# EAGLE design rgbbOX2 (EAGLE 9.0.0)

## Sheet 1 of 2: brains
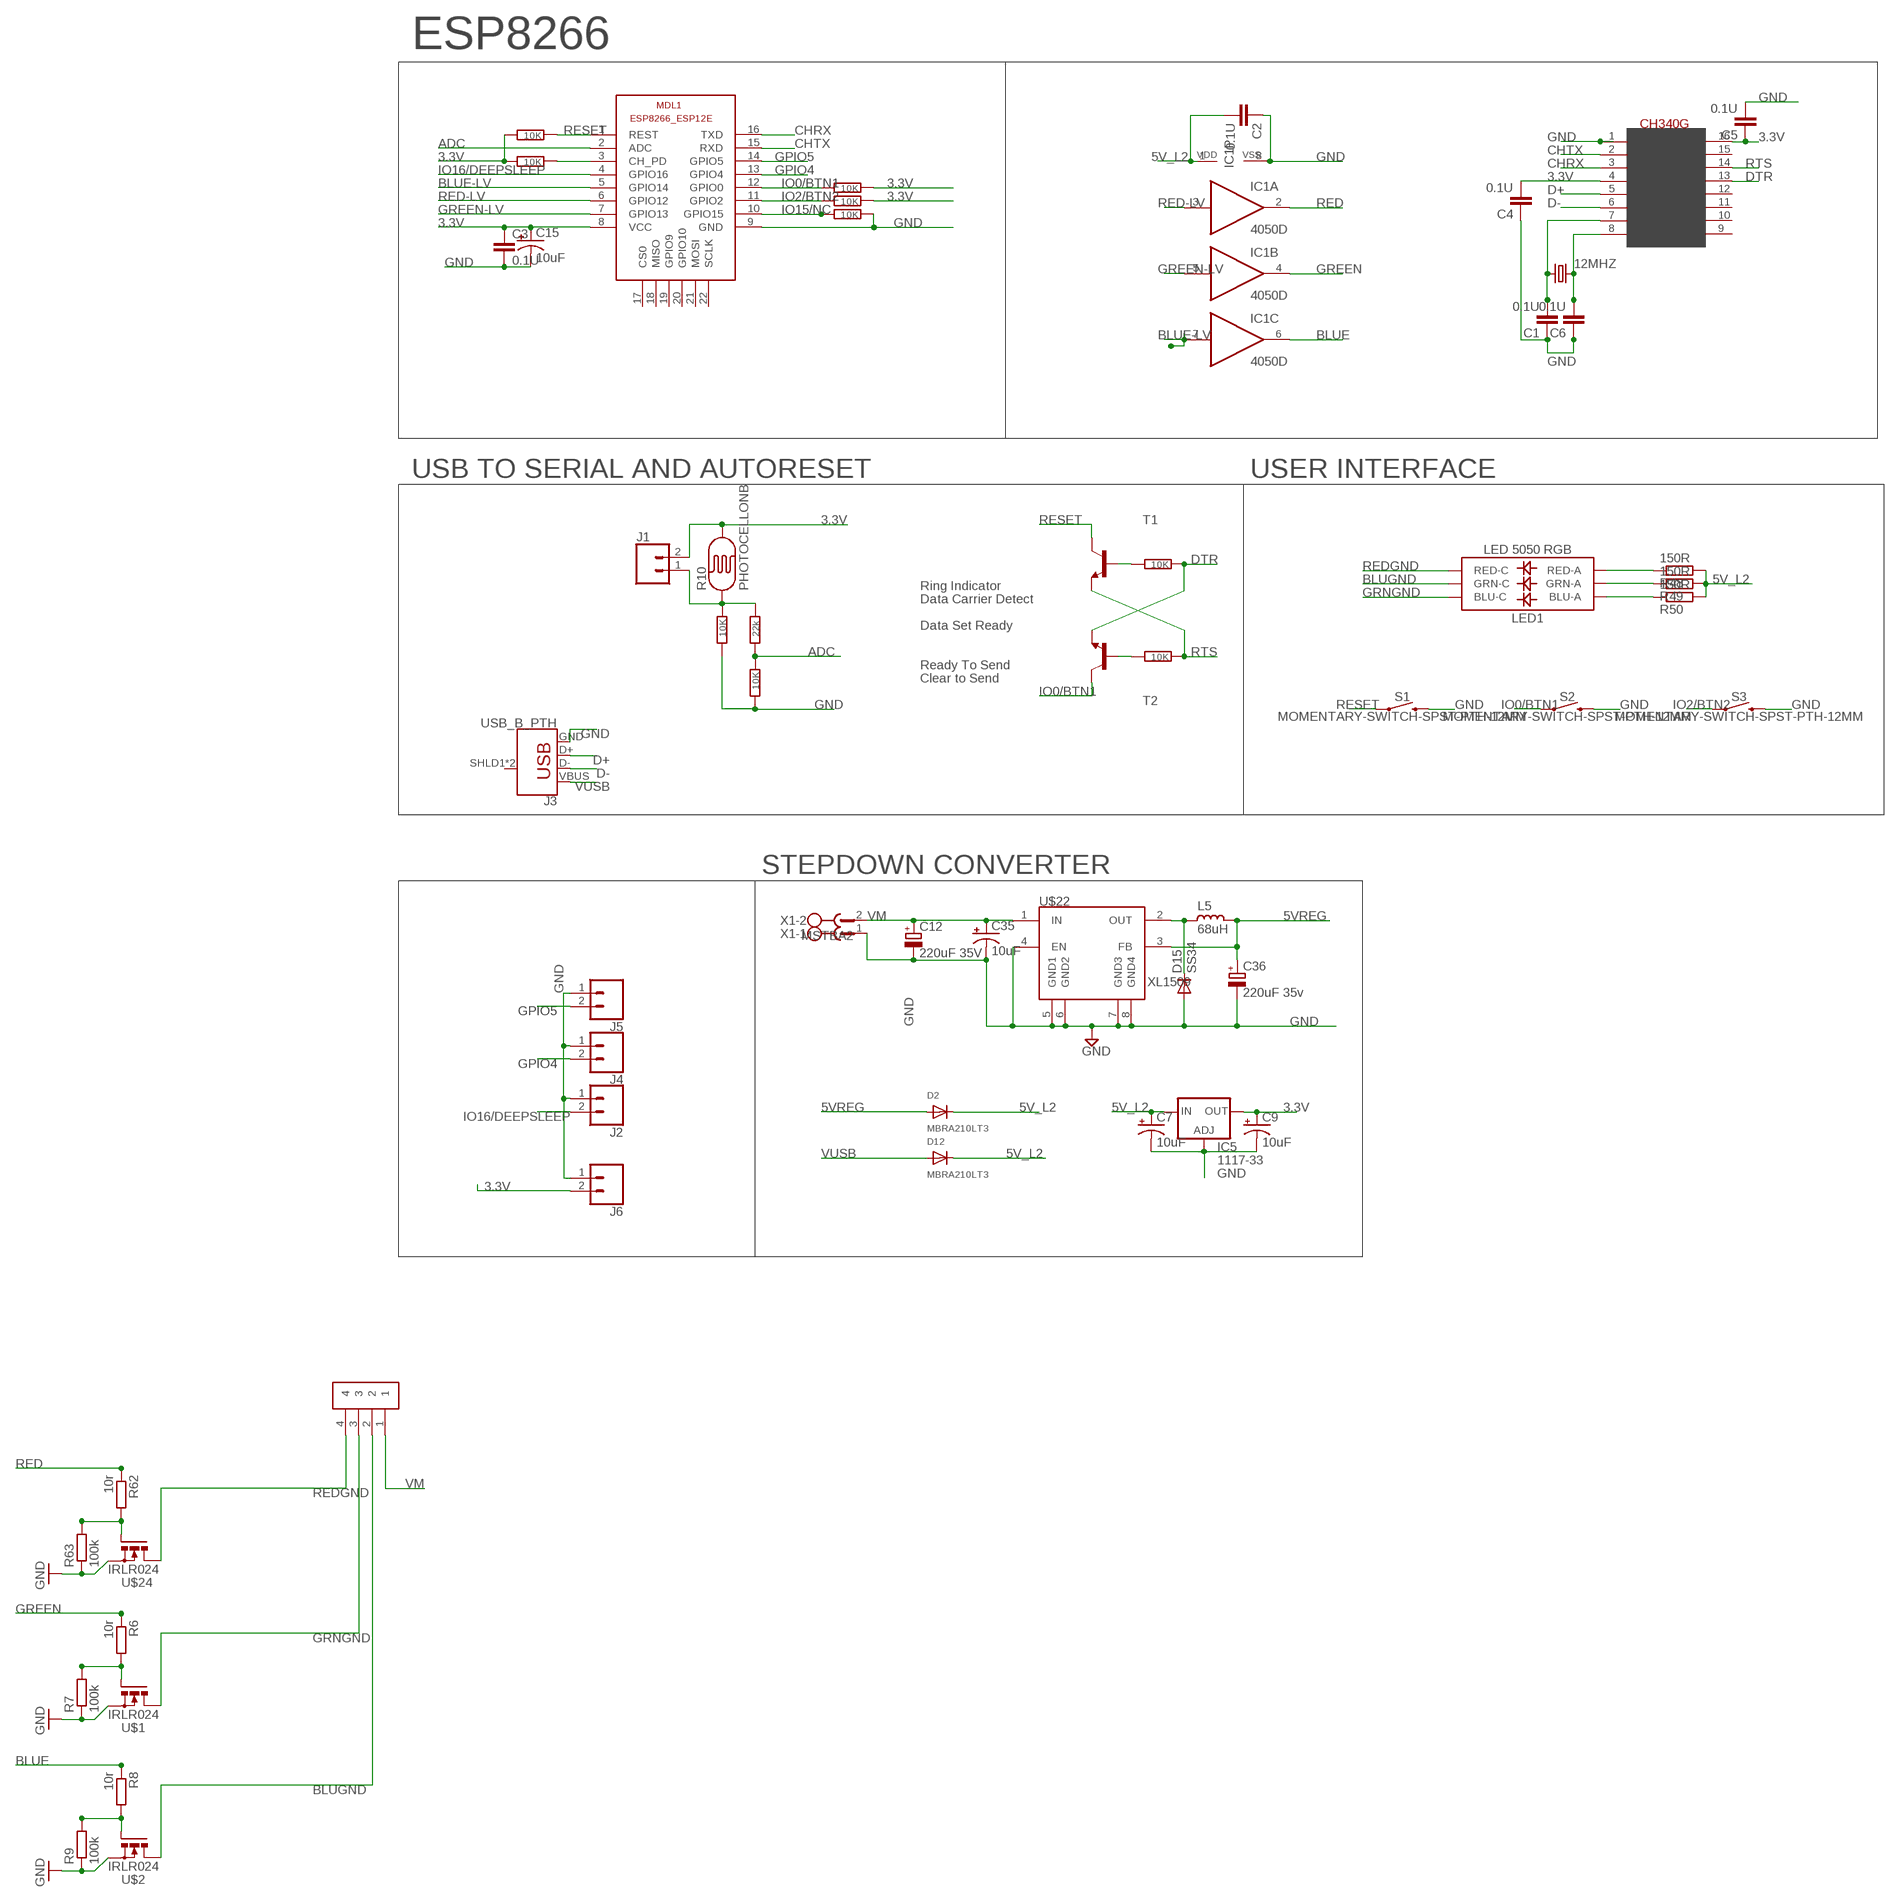
[diagram p0: schematic, sheet 1]

### Parts
12MHZ  CRYSTALHC49UP  [HC49UP]
C1  0.1U  C-EUC1206  [C1206]
C2  0.1U  C-EUC1206  [C1206]
C3  0.1U  C-EUC1206  [C1206]
C4  0.1U  C-EUC1206  [C1206]
C5  0.1U  C-EUC1206  [C1206]
C6  0.1U  C-EUC1206  [C1206]
C7  10uF  CAP_POL1206  [EIA3216]
C9  10uF  CAP_POL1206  [EIA3216]
C12  220uF 35V  CPOL-EUE3.5-8  [E3,5-8]
C15  10uF  CAP_POL1206  [EIA3216]
C35  10uF  CAP_POL1206  [EIA3216]
C36  220uF 35v  CPOL-EUE3.5-8  [E3,5-8]
CON25  Phoenix Pluggable 3.81mm 4 way  CONNECTOR-M4  [3.81MM-4WAY-PLUGGABLE-SCREW]
D2  MBRA210LT3  DIODESMA  [SMADIODE]
D12  MBRA210LT3  DIODESMA  [SMADIODE]
D15  SS34  DIODE-DO-214AC  [DO-214AC]
IC1  4050D  [SO16]
IC5  1117-33  LD117AS33TR  [SOT223]
J1  CONN_02LOCK  [1X02_LOCK]
J2  CONN_02LOCK  [1X02_LOCK]
J3  USB_B_PTH  [USB-B-PTH]
J4  CONN_02LOCK  [1X02_LOCK]
J5  CONN_02LOCK  [1X02_LOCK]
J6  CONN_02LOCK  [1X02_LOCK]
L5  68uH  L_CD75  [CD75]
LED1  LED 5050 RGB  LED-RGBNO_IC  [LED-TRICOLOR-5050]
MDL1  ESP8266-12EESP8266-ESP12E  [ESP8266-ESP12E]
R1  10K  R-EU_R1206  [R1206]
R2  10K  R-EU_R1206  [R1206]
R3  22k  R-EU_R1206  [R1206]
R4  10K  R-EU_R1206  [R1206]
R5  10K  R-EU_R1206  [R1206]
R6  10r  R-EU_R1206  [R1206]
R7  100k  R-EU_R1206  [R1206]
R8  10r  R-EU_R1206  [R1206]
R9  100k  R-EU_R1206  [R1206]
R10  PHOTOCELLONB  [ON_BOARD]
R11  10K  R-EU_R1206  [R1206]
R12  10K  R-EU_R1206  [R1206]
R28  10K  R-EU_R1206  [R1206]
R29  10K  R-EU_R1206  [R1206]
R31  10K  R-EU_R1206  [R1206]
R48  150R  R-EU_R1210  [R1210]
R49  150R  R-EU_R1210  [R1210]
R50  150R  R-EU_R1210  [R1210]
R62  10r  R-EU_R1206  [R1206]
R63  100k  R-EU_R1206  [R1206]
S1  MOMENTARY-SWITCH-SPST-PTH-12MM  [TACTILE_SWITCH_PTH_12MM]
S2  MOMENTARY-SWITCH-SPST-PTH-12MM  [TACTILE_SWITCH_PTH_12MM]
S3  MOMENTARY-SWITCH-SPST-PTH-12MM  [TACTILE_SWITCH_PTH_12MM]
T1  MMBT2222ALT1-NPN-SOT23-BEC  [SOT23-BEC]
T2  MMBT2222ALT1-NPN-SOT23-BEC  [SOT23-BEC]
U$1  IRLR024  N-POWER-MOSFETDPAK-MOSFET  [D-PAK_TO252AA]
U$2  IRLR024  N-POWER-MOSFETDPAK-MOSFET  [D-PAK_TO252AA]
U$4  CH340G  [SOIC16]
U$22  XL1509  [SO08]
U$24  IRLR024  N-POWER-MOSFETDPAK-MOSFET  [D-PAK_TO252AA]
X1  MSTBA2  [MSTBA2]

### Nets
3.3V: C3.1 C4.2 C5.1 C9.A(+) C15.A(+) IC5.4(OUT) J1.2 J6.2 MDL1.8(VCC) R10.2 R11.2 R12.2 R28.1 R29.1 U$4.4(V3) U$4.16(VCC)
5V_L2: C2.2 C7.A(+) D2.C D12.C IC1.1(P:VDD) IC5.3(IN) R48.2 R49.2 R50.2
5VREG: C36.+ D2.A L5.1 U$22.3(FB)
ADC: MDL1.2(ADC) R3.1 R4.2
BLUE: IC1.6(C:O) R8.1
BLUE-LV: IC1.7(C:I) MDL1.5(GPIO14)
BLUGND: CON25.2 LED1.6(GRN-C) U$2.4(D)
CHRX: MDL1.16(TXD) U$4.3(RX)
CHTX: MDL1.15(RXD) U$4.2(TX)
D+: J3.D+ U$4.5(D+)
D-: J3.D- U$4.6(D-)
DTR: R1.2 T2.E U$4.13(DTR)
GND: C1.1 C2.1 C3.2 C4.1 C5.2 C6.1 C7.C(-) C9.C(-) C12.- C15.C(-) C35.C(-) C36.- D15.2(A) IC1.8(P:VSS) IC5.1(ADJ) J2.1 J3.GND J4.1 J5.1 J6.1 MDL1.9(GND) R4.1 R5.1 R7.1 R9.1 R31.2 R63.1 S1.3 S2.3 S3.3 U$1.3(S) U$2.3(S) U$4.1(GND) U$22.4(EN) U$22.5(GND1) U$22.6(GND2) U$22.7(GND3) U$22.8(GND4) U$24.3(S) X1.1
GPIO4: J4.2 MDL1.13(GPIO4)
GPIO5: J5.2 MDL1.14(GPIO5)
GREEN: IC1.4(B:O) R6.1
GREEN-LV: IC1.5(B:I) MDL1.7(GPIO13)
GRNGND: CON25.3 LED1.4(BLU-C) U$1.4(D)
IO0/BTN1: MDL1.12(GPIO0) R12.1 S2.1 T2.C
IO2/BTN2: MDL1.11(GPIO2) R11.1 S3.1
IO15/NC: MDL1.10(GPIO15) R31.1
IO16/DEEPSLEEP: J2.2 MDL1.4(GPIO16)
N$2: R6.2 R7.2 U$1.1(G)
N$3: R62.2 R63.2 U$24.1(G)
N$4: D15.1(C) L5.2 U$22.2(OUT)
N$5: 12MHZ.1 C1.2 U$4.7(XI)
N$6: 12MHZ.2 C6.2 U$4.8(XO)
N$7: R8.2 R9.2 U$2.1(G)
N$9: R1.1 T1.B
N$10: R2.1 T2.B
N$15: J1.1 R3.2 R5.2 R10.1
N$18: MDL1.3(CH_PD) R28.2
N$93: LED1.3(BLU-A) R50.1
N$94: LED1.1(GRN-A) R49.1
N$95: LED1.2(RED-A) R48.1
RED: IC1.2(A:O) R62.1
RED-LV: IC1.3(A:I) MDL1.6(GPIO12)
REDGND: CON25.4 LED1.5(RED-C) U$24.4(D)
RESET: MDL1.1(REST) R29.2 S1.1 T1.C
RTS: R2.2 T1.E U$4.14(RTS)
VM: C12.+ C35.A(+) CON25.1 U$22.1(IN) X1.2
VUSB: D12.A J3.VBUS
Unconnected: IC1.9(D:I) IC1.10(D:O) IC1.11(E:I) IC1.12(E:O) IC1.14(F:I) IC1.15(F:O) J3.SHLD1(SHIELD) J3.SHLD2(SHIELD) MDL1.17(CS0) MDL1.18(MISO) MDL1.19(GPIO9) MDL1.20(GPIO10) MDL1.21(MOSI) MDL1.22(SCLK) U$4.9(CTS) U$4.10(DSR) U$4.11(RI) U$4.12(DCD) U$4.15(RS232)

### Notes on the sheet
- ESP8266
- USB TO SERIAL AND AUTORESET | USER INTERFACE
- Ring Indicator
- Data Carrier Detect
- Data Set Ready
- Ready To Send
- Clear to Send
- STEPDOWN CONVERTER

## Sheet 2 of 2

## Library data of the parts
12MHZ = crystal:CRYSTAL: CRYSTAL; OC_FARNELL: unknown; OC_NEWARK: unknown
C1-C6 = rcl:C-EU: CAPACITOR, European symbol
C7 C9 C15 C35 = SparkFun:CAP_POL: Capacitor Polarized These are standard SMD and PTH capacitors. Normally 10uF, 47uF, and 100uF in electrolytic and tantalum varieties. Always verify the external diameter of the through hole cap, it varies with capacity, voltage, and manufacturer. The EIA devices should be standard.
C12 C36 = rcl:CPOL-EU: POLARIZED CAPACITOR, European symbol
CON25 = openbuilds-eagle-library:CONNECTOR-M4
D2 D12 = microbuilder:DIODE: Diode SMADIODE - SMA Surface Mount Package 20V 1A Schottky Diode Digikey (500mV @ 1A, 500uA Vr @ 20V): 641-1014-6-ND 10V 2A Schottky Diode Digikey (350mV @ 2A, 700uA Vr @ 10V): MBRA210LT3 SOD-123 30V 200mA (800mV Vf, 2uA Vr @ 25V) Schottky Diode (very fast switching for boost, etc.) - Digikey: BAT54T1GOSTR-ND 30V 500mA (430mV Vf, 130uA Vr @ 30V) Schottky Diode - Digikey: B0530W-FDICT-ND MBR120 1A 20V (0.34Vf) Schottky Diode - Digikey: MBR120VLSFT1GOSCT-ND SOD-323 10V 570mA (380mV Vf, 3ns) Schottky Diode - Digikey: ZLLS410CT-ND 1N4148WS - 75V 150mA (1V Vf @ 10mA, 4ns) Simple Diode - Digikey: 1N4148WSFSCT-ND, Mouser: 512-1N4148WS SOD-523 BAT54 30V 200mA Schottky (0.8 Vf @ 100mA, 5ns) - Digikey: BAT54XV2CT-ND 30V 30mA Schottky Diode (RB751S-40TE61) - Digikey: RB751S-40TE61CT-ND SOT23-R/W - SOT23 Package (R = Solder Paste/Reflow Ovens, W = Hand-Soldering) BAT54Film 40V 300mA - Digikey: 497-7162-1-ND DO-1N4148 Through Hole Small Current Diode (any model)
D15 = dp_devices:DIODE: Various Diode Packages
IC1 = 40xx:4050: Hex non-inverting BUFFER
IC5 = v-reg:LD117A?*: Low drop fixed and adjustable positive voltage regulators 1 A Source: http://www.st.com/stonline/products/literature/ds/7194/ld1117axx.pdf
J1 J2 J4-J6 = SparkFun-Connectors:CONN_02: Multi connection point. Often used as Generic Header-pin footprint for 0.1 inch spaced/style header connections On any of the 0.1 inch spaced packages, you can populate with these: Break Away Headers - Straight <https://www.sparkfun.com/products/116> (PRT-00116) Break Away Male Headers - Right Angle <https://www.sparkfun.com/products/553> (PRT-00553) Female Headers <https://www.sparkfun.com/products/115> (PRT-00115) Break Away Headers - Machine Pin <https://www.sparkfun.com/products/117> (PRT-00117) Break Away Female Headers - Swiss Machine Pin <https://www.sparkfun.com/products/743> (PRT-00743) For SCREWTERMINALS and SPRING TERMINALS visit here: Screw Terimnals on SparkFun.com <https://www.sparkfun.com/search/results?term=Screw+Terminals> (5mm/3.5mm/2.54mm spacing) This device is also useful as a general connection point to wire up your design to another part of your project. Our various solder wires solder well into these plated through hole pads. Hook-Up Wire - Assortment (Stranded, 22 AWG) <https://www.sparkfun.com/products/11375> (PRT-11375) Hook-Up Wire - Assortment (Solid Core, 22 AWG) <https://www.sparkfun.com/products/11367> (PRT-11367) View the entire wire category on our website here <https://www.sparkfun.com/categories/141> Special notes: Molex polarized connector foot print use with: PRT-08233 with associated crimp pins and housings. 2.54_SCREWTERM for use with PRT-10571. 3.5mm Screw Terminal footprints for PRT-08084 5mm Screw Terminal footprints for use with PRT-08432
J3 = SparkFun-Connectors:USB_B: USB Type B Connector SparkFun Products: SparkFun Stepoko <https://www.sparkfun.com/products/13899> PTH; PROD_ID: CONN-08278; SF_ID: PRT-00139
L5 = rc-master-smd:L_: INDUCTOR
LED1 = SparkFun-LED:LED-RGB: LED-RGB 6 pin RGB LED (no common connector) Packages: PLCC-6 LED-TRICOLOR-5050 - No built-in IC SparkFun Products: Digital Sandbox <https://www.sparkfun.com/products/12651> LED- SMD RGB <https://www.sparkfun.com/products/10866>; PROD_ID: DIO-10298
MDL1 = ESP8266-ESP12E:ESP8266-12E: ESP8266-12E with additional I/O and GPIO04/05 corrected The author cannot warrant that this library is free from error or will meet your specific requirements. Created by PuceBaboon.com. Komagane, Nagano, JAPAN
R1-R5 R11 R12 R28 R29 R31 R48-R50 = rcl:R-EU_: RESISTOR, European symbol
R6-R9 R62 R63 = resistor:R-EU_: RESISTOR, European symbol
R10 = LDR:PHOTOCELL: Photo Resitor
S1-S3 = SparkFun-Switches:MOMENTARY-SWITCH-SPST: Momentary Switch (Pushbutton) - SPST Normally-open (NO) SPST momentary switches (buttons, pushbuttons). Variants PTH-12MM - 12mm square, through-hole Momentary Pushbutton Switch - 12mm Square <https://www.sparkfun.com/products/9190> (COM-09190) PTH-6.0MM, PTH-6.0MM-KIT - 6.0mm square, through-hole Mini Pushbutton Switch <https://www.sparkfun.com/products/97> (COM-00097) KIT package intended for soldering kit's - only one side of pads' copper is exposed. PTH-RIGHT-ANGLE-KIT - Right-angle, through-hole Right Angle Tactile Button <https://www.sparkfun.com/products/10791> - Used on SparkFun BigTime Watch Kit <https://www.sparkfun.com/products/11734> SMD-12MM - 12mm square, surface-mount Tactile Button - SMD (12mm) <https://www.sparkfun.com/products/12993> (COM-12993) Used on SparkFun PicoBoard <https://www.sparkfun.com/products/11888> SMD-4.5MM - 4.5mm Square Trackball Switch Used on SparkFun Blackberry Trackballer Breakout <https://www.sparkfun.com/products/13169> SMD-4.6MMX2.8MM - 4.60mm x 2.80mm, surface mount Used on SparkFun SAMD21 Mini Breakout <https://www.sparkfun.com/products/13664> SMD-5.2MM, SMD-5.2-REDUNDANT - 5.2mm square, surface-mount Mini Pushbutton Switch - SMD <https://www.sparkfun.com/products/8720> (COM-08720) Used on Arduino Pro Mini <https://www.sparkfun.com/products/11114> REDUNDANT package connects both switch circuits together SMD-6.0X3.5MM - 6.0 x 3.5mm, surface mount Momentary Reset Switch SMD <https://www.sparkfun.com/products/8229> (COM-08229) SMD-6.2MM-TALL - 6.2mm square, surface mount Tactile Button - SMD (6mm) <https://www.sparkfun.com/products/12992> Used on SparkFun Digital Sandbox <https://www.sparkfun.com/products/12651> SMD-RIGHT-ANGLE - Right-angle, surface mount Used on SparkFun Block for Intel® Edison - Arduino <https://www.sparkfun.com/products/13036>; PROD_ID: SWCH-09185; SF_SKU: COM-09190
T1 T2 = transistor:*-NPN-: NPN Transistror BF959 corrected 2008.03.06
U$1 U$2 U$24 = Cohesion_parts:N-POWER-MOSFET
U$4 = usb-serial:CH340G
U$22 = Cohesion_parts:XL1509
X1 = con-phoenix-508:MSTBA2: PHOENIX; MF: FARNELL; MPN: 1757242; OC_FARNELL: 3705171; OC_NEWARK: 71C4161

## Net classes
2 gnd: width 0.254 mm, clearance 0.152 mm

## Board
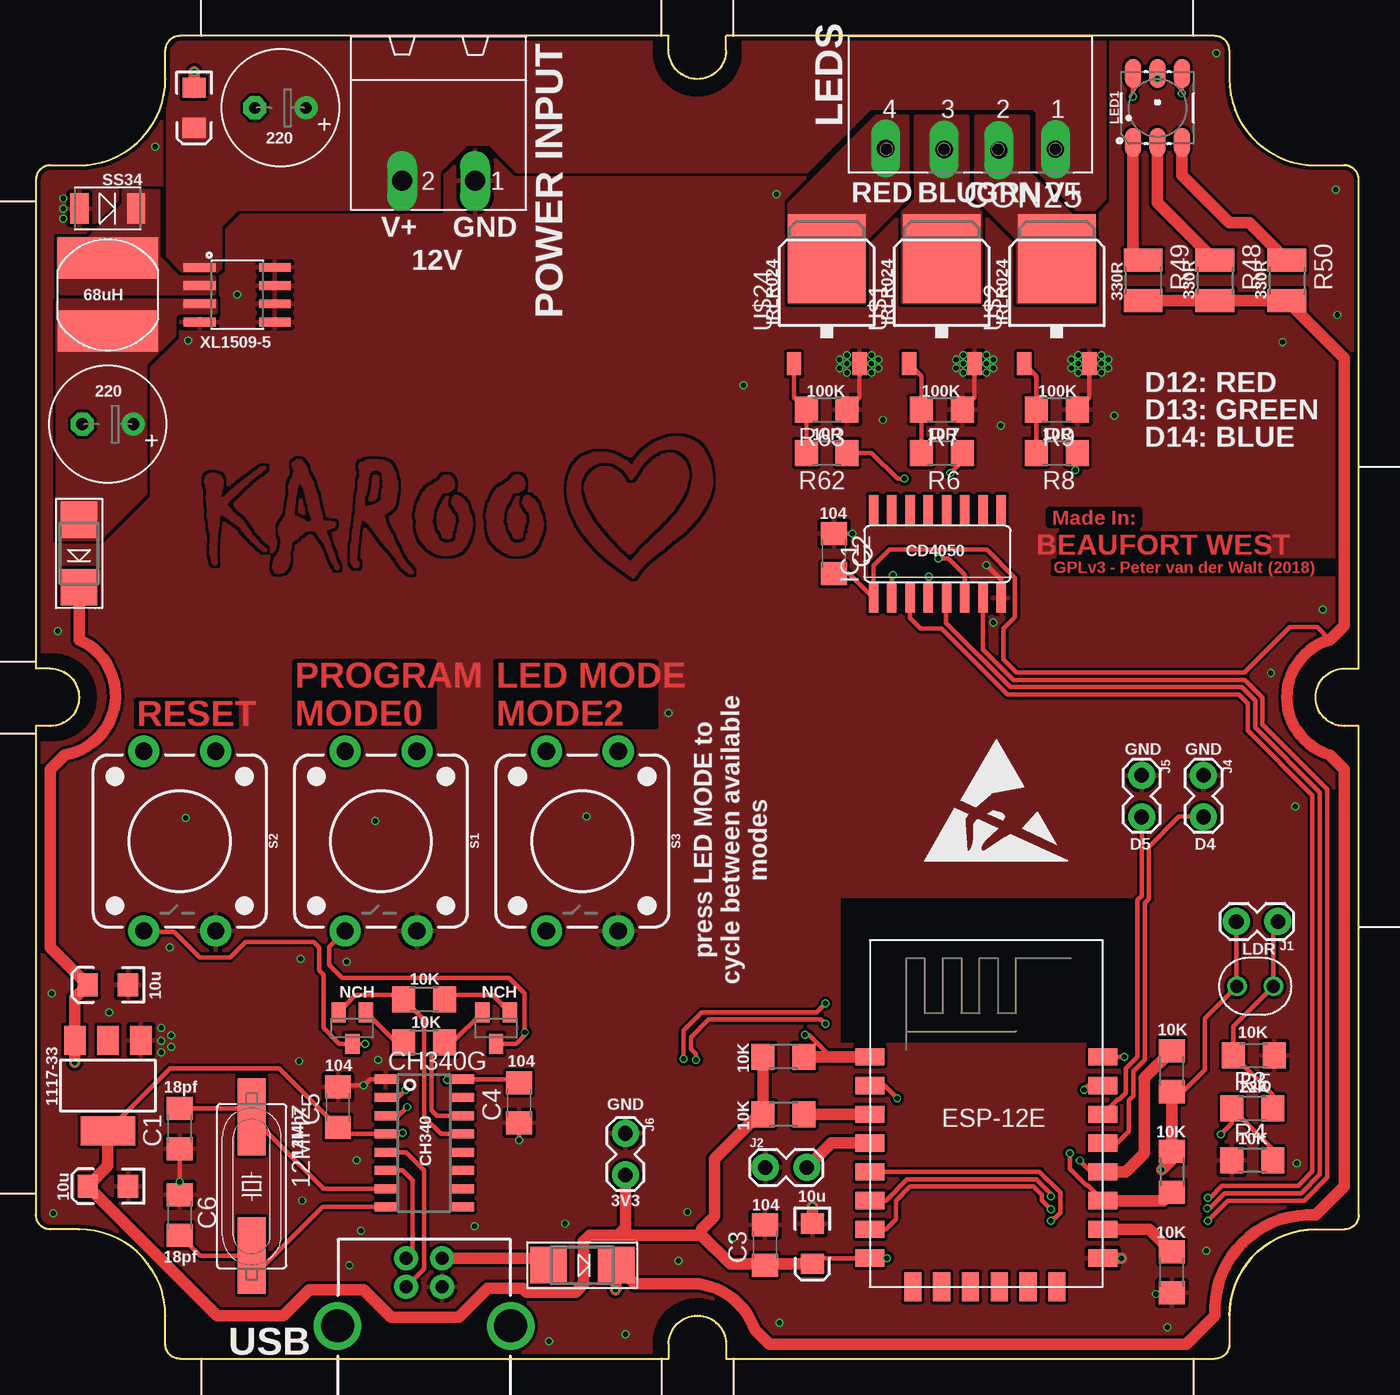
[diagram p1: board, top side]
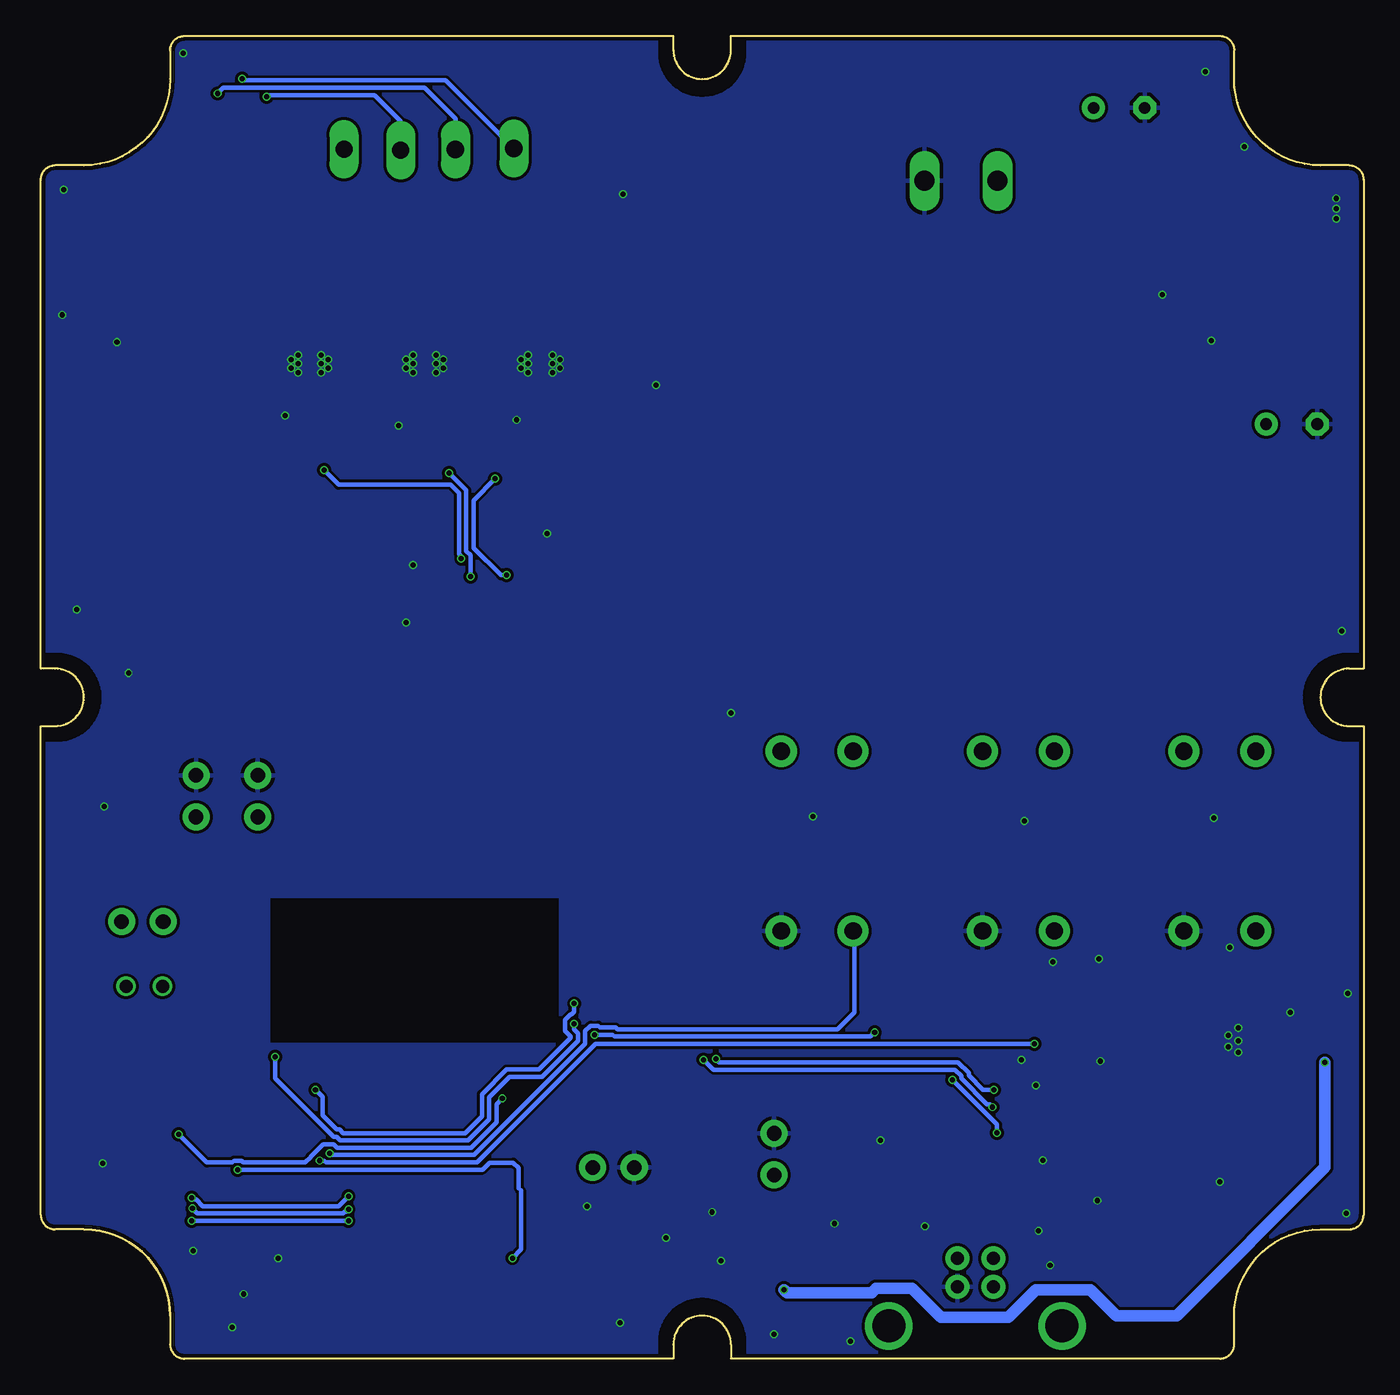
[diagram p2: board, bottom side, seen from below]

Size 92 x 92 mm. Coordinates in mm from the lower left corner, seen from the top.
Outline: 3,9 1,9 arc-90 0,10 0,44 1,44 arc180 1,48 0,48 0,82 arc-90 1,83 3,83
Outline: 89,83 91,83 arc-90 92,82 92,48 91,48 arc180 91,44 92,44 92,10 arc-90 91,9 89,9
Outline: 83,89 arc90 89,83
Outline: 83,3 arc-90 89,9
Outline: 3,83 arc90 9,89
Outline: 9,3 arc90 3,9
Outline: 83,3 83,1 arc-90 82,0 48,0 48,1 arc180 44,1 44,0 10,0 arc-90 9,1 9,3
Outline: 9,3 arc90 3,9
Outline: 89,9 arc90 83,3
Outline: 9,89 9,91 arc-90 10,92 44,92 44,91 arc180 48,91 48,92 82,92 arc-90 83,91 83,89
Outline: 83,89 arc90 89,83
Outline: 3,83 arc90 9,89
Copper layers (1*16): Top 0.035mm / dielectric 0.2mm / Bottom 0.035mm
Design rules "SeeedStudio_4layer_DRU_no_angle_20140221 *": minimum track width 8mil, minimum drill 12mil, track to track 8mil, track to pad 8mil, pad to pad 8mil, via to via 8mil, smd to smd 0mil, copper to edge 10mil, drill to drill 8mil, minimum pad ring 6mil, minimum via ring 4mil, stop-mask expansion 4mil, vias tented up to drill 25mil, thermal gap 10mil
tRestrict: area 0,43 to 4.2,49; area 43,87.8 to 49,92; area 87.8,43 to 92,49; area 43,0 to 49,4.2; area 56,22 to 76,32
bRestrict: area 43,0 to 49,4.2; area 87.8,43 to 92,49; area 43,87.8 to 49,92; area 0,43 to 4.2,49; area 56,22 to 76,32

### Footprints (pad centres in the part's own frame; a part is rotated, then mirrored left to right if it is on the bottom)
HC49UP = smd 5.334 x 1.93: 1 -4.826,0; 2 4.826,0
C1206 = smd 1.6 x 1.8: 1 -1.4,0; 2 1.4,0
EIA3216 = smd 1.4 x 1.6: A 1.4,0; C -1.4,0
E3,5-8 = drill 0.813 pad 1.6: + -1.778,0 | drill 0.813 pad 1.6 octagon: - 1.778,0
3.81MM-4WAY-PLUGGABLE-SCREW = drill 1.2 pad 2.032 long: 1 5.905,-7.874; 2 1.968,-7.945; 3 -1.841,-7.889; 4 -5.905,-7.833
SMADIODE = smd 2.54 x 2.54: A 2.349,0; C -2.349,0
DO-214AC = smd 1.27 x 2.1: 1 -1.98,0; 2 1.98,0
SO16 = smd 0.66 x 2.032: 1 -4.445,-3.073; 2 -3.175,-3.073; 3 -1.905,-3.073; 4 -0.635,-3.073; 5 0.635,-3.073; 6 1.905,-3.073; 7 3.175,-3.073; 8 4.445,-3.073; 9 4.445,3.073; 10 3.175,3.073; 11 1.905,3.073; 12 0.635,3.073; 13 -0.635,3.073; 14 -1.905,3.073; 15 -3.175,3.073; 16 -4.445,3.073
SOT223 = smd 1.5 x 2: 1 -2.3,-3.15; 2 0,-3.15; 3 2.3,-3.15 | smd 3.8 x 2: 4 0,3.15
1X02_LOCK = drill 1.016 pad 1.88: 1 -0.178,0; 2 2.718,0
USB-B-PTH = drill 0.914 pad 1.676: D+ 4,1.25; D- 5.981,1.25; GND 4,-1.25; VBUS 5.981,-1.25 | drill 2.286: SHLD1 1.282,-6.02; SHLD2 1.282,6.02
CD75 = smd 7 x 2.85: 1 0,2.54; 2 0,-2.54
LED-TRICOLOR-5050 = smd 2 x 1.1: 1 -2.4,1.7; 2 -2.4,0; 3 -2.4,-1.7; 4 2.4,-1.7; 5 2.4,0; 6 2.4,1.7
ESP8266-ESP12E = smd 2 x 1.2: 1 0,16; 2 0,14; 3 0,12; 4 0,10; 5 0,8; 6 0,6; 7 0,4; 8 0,2; 9 16.2,2; 10 16.2,4; 11 16.2,6; 12 16.2,8; 13 16.2,10; 14 16.2,12; 15 16.2,14; 16 16.2,16 | smd 1.2 x 2: 17 11,0; 18 3,0; 19 5,0; 20 13,0; 21 7,0; 22 9,0
R1206 = smd 1.6 x 1.803: 1 -1.422,0; 2 1.422,0
ON_BOARD = drill 0.9: 1 -1.27,0; 2 1.27,0
R1210 = smd 1.6 x 2.7: 1 -1.4,0; 2 1.4,0
TACTILE_SWITCH_PTH_12MM = drill 1.2 pad 2.159: 1 6.25,-2.5; 2 -6.25,-2.5; 3 6.25,2.5; 4 -6.25,2.5
SOT23-BEC = smd 1 x 1.4: B -0.95,-1.1; C 0,1.1; E 0.95,-1.1
D-PAK_TO252AA = smd 1 x 1.6: 1 -2.28,-4.8; 3 2.28,-4.8 | smd 5.4 x 6.2: 4 0,2.5
SOIC16 = smd 0.635 x 1.524: 1 -4.445,-2.695; 2 -3.175,-2.695; 3 -1.905,-2.695; 4 -0.635,-2.695; 5 0.635,-2.695; 6 1.905,-2.695; 7 3.175,-2.695; 8 4.445,-2.695; 9 4.445,2.695; 10 3.175,2.695; 11 1.905,2.695; 12 0.635,2.695; 13 -0.635,2.695; 14 -1.905,2.695; 15 -3.175,2.695; 16 -4.445,2.695
SO08 = smd 0.61 x 2.21: 1 -1.905,-2.616; 2 -0.635,-2.616; 3 0.635,-2.616; 4 1.905,-2.616; 5 1.905,2.616; 6 0.635,2.616; 7 -0.635,2.616; 8 -1.905,2.616
MSTBA2 = drill 1.397 long: 1 -2.54,5.08; 2 2.54,5.08

### Placement (x,y rotation side)
12MHZ  15,12 270 top
C1  10,16 90 top
C2  55.5,56 270 top
C3  50.7,7.9 90 top
C4  33.6,17.8 90 top
C5  21,17.5 90 top
C6  10,10 270 top
C7  5,26 180 top
C9  54,8 270 top
C12  17,87 180 top
C15  5,12 180 top
C35  11,87 270 top
C36  5,65 180 top
CON25  65,92 0 top
D2  3,56 90 top
D12  38,6.5 180 top
D15  5,80 180 top
IC1  62.7,55.98 0 top
IC5  5,19 180 top
J1  86.2,30.4 180 top
J2  50.9,13.3 0 top
J3  27,1 90 top
J4  81.2,40.4 270 top
J5  76.9,40.4 270 top
J6  41,15.5 270 top
L5  5,74 180 top
LED1  78,87 90 top
MDL1  58,5 0 top
R1  27,25 180 top
R2  27,22 0 top
R3  84.6,17.4 0 top
R4  84.6,13.8 0 top
R5  84.7,21.1 180 top
R6  63,63 180 top
R7  63,66 180 top
R8  71,63 180 top
R9  71,66 180 top
R10  84.8,25.9 180 top
R11  79,13 90 top
R12  79,20 270 top
R28  52,17 0 top
R29  52,21 0 top
R31  79,6 270 top
R48  82,75 270 top
R49  77,75 270 top
R50  87,75 270 top
R62  55,63 180 top
R63  55,66 180 top
S1  24,36 270 top
S2  10,36 270 top
S3  38,36 270 top
T1  32,23 180 top
T2  22,23 180 top
U$1  63,74 0 top
U$2  71,74 0 top
U$3  [ESD_10.00]  61.7,34.5 0 top
U$4  27,15 270 top
U$22  14,74 270 top
U$24  55,74 0 top
X1  28,87 180 top

### Tracks (layer width: path | path; a pad name or v marks a point on that pad's centre or on a via)
3.3V  (via drill 0.35)
  Top 0.305: v28.6,19.4 28.64,19.45 U$4.16 33.36,19.45 C4.2 | v25.5,15.7 25.43,15.64 U$4.4 21.46,15.64 C5.1 16.9,20.2 9.35,20.2 IC5.4 | R11.2 79,13.85 | v59.2,7 MDL1.8 54.4,7 C9.A | C3.1 49.5,6.5 49.4,6.6 | R12.2 79.78,18.58 81.3,20.1 81.3,23.67 R10.2 83.48,25.95 J1.2
  Top 0.8: R28.1 50.3,17 47.2,13.9 47.2,9.9 46.3,9 46.3,8.6 | J6.2 41,9.1 40.5,8.6
  Top 0.813: IC5.4 5,13.4 C15.A 12.6,3 17.2,3 19,4.8 22.8,4.8 24.7,2.9 29.4,2.9 31.4,4.9 33.85,4.9 34.13,4.62 37.52,4.62 38.1,5.2 38.1,8.2 38.5,8.6 40.5,8.6 46.3,8.6 48.3,6.6 49.4,6.6 C9.A | R12.2 R11.2 | 79,13.85 v78.3,13.15 | R29.1 R28.1
  Bottom 0.305: v28.6,19.4 25.5,16.3 v25.5,15.7 | v78.3,13.15 61.29,13.15 60.8,13.63 59.14,13.63 58.77,13.26 58.77,11.87 58.6,11.7 58.6,7.6 v59.2,7
5V_L2  (via drill 0.35)
  Top 0.305: 90,50 89.1,50.9 87.2,50.9 84.03,47.73 68.19,47.73 67.3,48.62 67.3,50.8 68.1,51.6 68.1,54.3 66.12,56.28 59.38,56.28 58.26,55.16 IC1.1 56.56,54.6 C2.2
  Top 0.813: R49.2 R48.2 R50.2 91,69.6 91,51 90,50 arc147 90,42 91,41 91,12 89,10 arc97 82,3 80,1 51,1 50,2 arc64 46.1,5.2 41.65,5.2 D12.C 40.35,4.85 v40.3,4.8 | D2.C 3,50 arc-147 2,42 1,41 1,28.6 C7.A 2.7,25.1 IC5.3 v2.7,20.6
  Bottom 0.813: v40.3,4.8 40.1,4.6 34.2,4.6 33.9,4.9 31.4,4.9 29.4,2.9 24.7,2.9 22.8,4.8 19,4.8 17.2,3 13,3 2.7,13.3 v2.7,20.6
5VREG
  pour Top (rank 2, no thermals): 12.5,73.6 1.7,73.6 1.5,73.4 1.5,57 4.4,57 7.6,60.2 7.6,69.2 9.6,71.2 9.6,72.5 9.9,72.8 12.5,72.8
ADC  (via drill 0.35)
  Top 0.305: R4.2 86.02,14.56 R3.1 83.18,16.38 v82.4,15.6 | MDL1.2 59,19 v59.9,18.1
  Bottom 0.305: v59.9,18.1 60.3,17.7 60.3,16.44 62.06,14.67 71.38,14.67 71.63,14.92 72.35,14.92 73.23,14.04 73.23,14.02 73.6,13.66 77.91,13.66 78.04,13.78 78.56,13.78 78.69,13.66 80.46,13.66 v82.4,15.6
BLUE  (via drill 0.35)
  Top 0.305: IC1.6 64.61,54.49 63.46,55.64 v62.76,55.64 | v72.3,61.8 72.3,62.88 R8.1
  Bottom 0.305: v62.76,55.64 62.76,55.82 62.92,55.98 62.92,60.2 63.51,60.79 71.29,60.79 v72.3,61.8
BLUE-LV  (via drill 0.35)
  Top 0.305: IC1.7 65.88,49.33 67.98,47.22 84.08,47.22 85.3,46 85.3,44.1 89.8,39.6 89.8,12.6 88.2,11 82.9,11 v81.5,9.6 | MDL1.5 69.79,13 71.23,11.56 71.23,10.14 70.86,9.77 70.77,9.77 v70.6,9.6
  Bottom 0.305: v81.5,9.6 v70.6,9.6
BLUGND  (via drill 0.35)
  Top 0.305: v76.3,87.77 LED1.6
  Bottom 0.305: CON25.2 66.97,86.07 68.79,87.89 76.18,87.89 v76.3,87.77
  pour Top (rank 2, no thermals): 65.4,86.4 65.4,80.8 68.3,77.9 68.3,73.5 73.6,73.5 73.6,77.9 69,82.5 69,86.4
CHRX  (via drill 0.35)
  Top 0.305: U$4.3 25.2,16.91 v25.8,17.5 | v45.9,20.8 45.9,21.2 45.56,21.54 45.56,22.36 46.79,23.59 54.61,23.59 v54.9,23.3 | v75.7,21 MDL1.16
  Bottom 0.305: v25.8,17.5 26,17.7 26.18,17.7 27.97,19.49 27.97,19.66 28.41,20.1 45.2,20.1 v45.9,20.8 | v75.7,21 75.7,19.5 71.63,15.43 71.42,15.43 71.17,15.18 62.27,15.18 60.81,16.65 60.81,18.19 59.4,19.6 57.14,19.6 55.92,20.82 55.85,20.89 54.64,22.1 54.64,22.64 54.9,22.9 v54.9,23.3
CHTX  (via drill 0.35)
  Top 0.305: U$4.2 25.18,18.18 v25.7,18.7 | v45.05,20.85 45.05,22.85 46.3,24.1 54.3,24.1 v54.9,24.7 | MDL1.15 73.2,19 v72.9,18.7
  Bottom 0.305: v25.7,18.7 26.46,18.7 27.46,19.7 27.46,19.87 28.2,20.61 44.81,20.61 v45.05,20.85 | v72.9,18.7 72.4,18.2 72.4,16.92 71.42,15.94 71.21,15.94 70.96,15.69 62.48,15.69 61.32,16.86 61.32,18.4 59.61,20.11 57.35,20.11 55.15,22.31 55.15,22.43 55.53,22.81 55.53,23.56 55.16,23.93 55.1,23.93 54.9,24.13 v54.9,24.7
D+
  Top 0.305: J3.D+ 27,6.25 27,13.1 25.73,14.36 U$4.5
D-
  Top 0.305: J3.D- 26.2,7.43 26.2,12.4 25.5,13.09 U$4.6
DTR
  Top 0.305: T2.E 22.25,25.3 24.9,25.3 25.2,25 R1.2 27,23.58 27,16.8 28.16,15.64 U$4.13
GND  (via drill 0.35)
  Top 0.305: C6.1 v10,12.3 C1.1 | U$2.3 73.28,66.86 R9.1 | U$1.3 65.28,66.86 R7.1 | U$24.3 57.28,66.86 R63.1 | R31.2 77.98,4.58 v77.9,4.5 | C2.1 v56.8,57.4 | IC1.8 67.14,54.16 v66.1,55.2 | C4.1 v33.6,15.2 | U$4.1 23.25,19.45 v22.8,19 21.1,19 C5.2
  Top 0.8: C35.C v11,89.5
  Top 0.813: MDL1.9 v75.5,7 | C9.C v54,10.6
  other vias: 56.4,69.8 56.4,69.2 56.4,68.6 58.1,68.6 58.1,69.2 58.1,69.8 58.6,69.5 58.6,68.9 55.9,68.9 55.9,69.5 64.5,69.8 64.5,69.2 64.5,68.6 64,68.9 64,69.5 66.1,69.8 66.1,69.2 66.1,68.6 66.6,68.9 66.6,69.5 72.5,69.8 72.5,69.2 72.5,68.6 72,69.5 72,68.9 74.1,68.6 74.1,69.2 74.1,69.8 74.6,69.5 74.6,68.9 1.9,79.3 1.9,80 1.9,80.7 41,1.7 14,74 10.6,70.8 66.6,51.2 85.9,47.7 89.5,52.1 87.6,38.4 87.7,13.6 81.4,7.5 78.7,2.2 51.7,2.5 44.7,6.8 48.5,8.4 45.3,10.2 36.8,9.4 35.7,1.2 21.8,6.5 30.5,9.2 22.6,8.9 23.8,20.8 21.6,27.6 18.4,27.8 9.3,28.6 5.1,24.1 8.7,22.1 8.7,23 8.7,21.3 9.4,22.5 9.4,21.7 10.4,37.6 23.6,37.4 38.3,37.7 44,44.9 51.5,81 49.2,67.7 58.9,65.3 67.1,64.9 75,65.6 86.7,70.7 90.5,72.6 90.4,81.3 82.1,90.8 8.3,84.3 1.5,50.6 1.1,25.4 1.2,10.1 18.5,11 22.3,13.8 18.3,20.7
  pour Top (rank 6): -2,92.5 92.4,92.5 92.4,-0.1 -2,-0.1
  pour Bottom (rank 6): -1.1,91.8 93.3,91.8 93.3,-0.8 -1.1,-0.8
  pour Top (rank 5): 11,63.7 46.6,65.1 48.8,61.6 45.3,53.2 22.9,51.7 9.8,53.8
GPIO4
  Top 0.305: MDL1.13 75.2,15 76,15.8 76,17.98 76.31,18.29 76.31,19.99 77.11,20.79 77.11,31.69 77.41,31.99 77.41,35.61 79.5,37.7 81.18,37.7 J4.2
GPIO5
  Top 0.305: J5.2 76.9,32.2 76.6,31.9 76.6,21 75.8,20.2 75.8,18.5 75.35,18.04 75.24,18.04 MDL1.14
GREEN  (via drill 0.35)
  Top 0.305: IC1.4 62.1,52.94 v62.1,54.4 | v63.6,61.6 64.42,62.42 R6.1
  Bottom 0.305: v62.1,54.4 62.1,55.88 62.41,56.19 62.41,60.41 v63.6,61.6
GREEN-LV  (via drill 0.35)
  Top 0.305: IC1.5 63.3,52.87 63.3,51.18 67.77,46.71 82.49,46.71 83.87,46.71 84.79,45.79 84.79,43.89 89.29,39.39 89.29,12.81 87.99,11.51 82.69,11.51 81.63,10.45 v81.45,10.45 | v70.6,10.4 69.97,11.03 69.97,11.39 69.37,11.98 60.8,11.98 59.81,10.99 59.81,9.71 59.1,9 MDL1.7
  Bottom 0.305: v81.45,10.45 81.11,10.11 70.99,10.11 70.86,10.23 70.77,10.23 v70.6,10.4
GRNGND  (via drill 0.35)
  Top 0.305: v79.7,88 LED1.4
  Bottom 0.305: CON25.3 63.16,86.26 65.3,88.4 79.3,88.4 v79.7,88
  pour Top (no thermals): 61.2,86.2 61.2,80.6 60.3,79.7 60.3,73.5 65.7,73.5 65.7,79.7 64.8,80.6 64.8,86.4 61.2,86.4
IO0/BTN1  (via drill 0.35)
  Top 0.305: S2.1 7.55,29.7 9.6,29.7 11.4,27.9 13.5,27.9 14.6,29 19.3,29 19.7,28.6 19.7,27 20,26.7 20,23 21.1,21.9 T2.C v22.9,21.9 | MDL1.12 73.38,13 v72.6,13.78
  Top 0.813: MDL1.12 75.8,13 77.1,14.3 77.1,19.52 R12.1
  Bottom 0.305: v72.6,13.78 72.28,13.78 72.16,13.66 61.64,13.66 53.4,21.9 v22.9,21.9
IO2/BTN2  (via drill 0.35)
  Top 0.305: MDL1.11 73.16,12.04 73.05,12.04 71.89,13.2 v71.89,14.29
  Top 0.813: MDL1.11 78.42,11 R11.1
  Bottom 0.305: v71.89,14.29 71.77,14.16 61.85,14.16 54.13,21.89 54.13,22.79 53.76,23.16 53.24,23.16 53.11,23.04 52.02,23.04 51.9,22.92 36.58,22.92 35.4,24.1 35.4,29.65 S3.1
IO15/NC
  Top 0.813: R31.1 77.42,9 MDL1.10
IO16/DEEPSLEEP
  Top 0.8: MDL1.4 55.32,15 J2.2
N$1
  pour Top (rank 2, no thermals): 259 corners
N$2
  Top 0.305: R6.2 R7.2 61.58,68.34 U$1.1
N$3
  Top 0.305: U$24.1 52.72,66.86 R63.2 R62.2
N$4
  pour Top (no thermals): 12.4,75.2 9.9,75.2 8.5,76.6 8.5,81.2 6.1,81.2 6.1,80.3 3.8,78 3.7,77.9 1.6,77.9 1.6,74.3 1.8,74.1 12.4,74.1
N$5
  Top 0.305: U$4.7 20,11.83 12MHZ.1 14.43,17.4 C1.2
N$6
  Top 0.305: U$4.8 19.95,10.55 15.4,6 15,6.4 12MHZ.2 11.43,7.17 C6.2
N$7
  Top 0.305: R8.2 R9.2 69.58,68.34 U$2.1
N$8
  pour Top (rank 2, no thermals): 22.37,60.32 22.32,60.03 22.88,60.03 22.89,60.08 22.99,60.35 23.1,60.92 23.1,61.11 23.14,61.33 23.18,61.5 23.21,61.62 23.26,61.7 23.55,61.81 23.62,61.8 23.69,61.84 23.84,61.77 24.02,61.71 24.11,61.58 24.11,61.18 24.15,61.09 24.15,61.06 24.14,61.02 24.13,60.98 24.11,60.87 24.12,60.81 24.13,60.78 24.14,60.74 24.15,60.7 24.17,60.65 24.06,60.42 24.05,60.23 24.05,60.04 24.01,59.93 24.05,59.83 24,59.69 23.82,59.54 23.67,59.43 23.37,59.37 23.12,59.3 23,59.23 22.89,59.27 22.81,59.33 22.83,59.49 22.81,59.61 22.83,59.86 22.88,60.02 22.32,60.02 22.27,59.76 22.26,59.49 22.23,59.24 22.23,58.99 22.22,58.79 22.17,58.61 22.16,58.33 22.11,58.06 22.09,57.82 22.04,57.59 22.03,57.42 22,57.26 21.97,57.1 21.97,56.85 21.95,56.72 21.9,56.51 21.88,56 21.88,55.68 21.9,55.41 22.03,55.18 22.08,55.09 22.16,55.02 22.28,54.99 22.4,55.04 22.46,55.13 22.49,55.23 22.44,55.39 22.36,55.5 22.32,55.57 22.32,55.66 22.34,56.1 22.34,56.29 22.36,56.6 22.43,57.14 22.49,57.35 22.49,57.59 22.55,57.97 22.62,58.22 22.63,58.33 22.79,58.33 23,58.2 23.2,58.01 23.38,57.78 23.57,57.52 23.75,57.24 24,56.92 24.17,56.68 24.39,56.46 24.62,56.22 24.83,55.94 24.98,55.77 25.1,55.55 25.25,55.33 25.44,55.07 25.62,54.89 25.88,54.69 25.99,54.62 26.08,54.57 26.18,54.57 26.24,54.62 26.23,54.73 26.18,54.81 26.08,54.95 25.95,55.1 25.76,55.3 25.61,55.5 25.51,55.67 25.38,55.88 25.3,56.08 25.23,56.31 25.1,56.52 25.02,56.69 24.88,56.97 24.79,57.18 24.7,57.36 24.5,57.73 24.36,58.09 24.33,58.24 24.27,58.41 24.22,58.56 24.22,58.73 24.34,58.81 24.49,58.9 24.64,59.03 24.79,59.14 24.93,59.33 25.03,59.57 25.07,59.76 25.08,59.98 25.11,60.21 25.14,60.41 25.17,60.66 25.14,60.78 25.15,61.02 25.07,61.22 25.07,61.39 24.97,61.67 24.87,61.88 24.77,62.08 24.61,62.25 24.46,62.37 24.32,62.43 24.15,62.51 23.81,62.54 23.51,62.55 23.22,62.54 23.01,62.51 22.8,62.36 22.58,62.33 22.49,62.15 22.46,61.96 22.54,61.76 22.5,61.57 22.54,61.39 22.48,61.22 22.41,61.02 22.4,60.72 22.4,60.52
N$9
  Top 0.305: R1.1 28.72,25.3 31.75,25.3 T1.B
N$10
  Top 0.305: T2.B 25.05,22 R2.1
N$11
  pour Top (rank 2, no thermals): 14.47,60.69 14.65,60.8 14.82,60.99 15.01,61.16 15.16,61.29 15.33,61.4 15.46,61.53 15.59,61.57 15.74,61.72 15.91,61.82 15.95,61.9 16,62 15.91,62.05 15.83,62.07 15.66,62.01 15.48,61.89 15.4,61.78 15.29,61.75 15.12,61.6 14.98,61.46 14.68,61.28 14.36,61.03 14.11,60.83 13.77,60.52 13.62,60.41 13.3,60.12 13.12,59.98 12.99,59.89 12.91,59.88 12.85,59.91 12.83,59.98 12.87,60.16 12.92,60.38 13,60.57 13.02,60.82 13.02,61.08 12.94,61.24 12.77,61.46 12.56,61.54 12.32,61.62 12.08,61.57 11.88,61.42 11.8,61.31 11.75,61.1 11.75,60.95 11.81,60.87 11.82,60.67 11.9,60.32 11.87,60.16 11.84,59.89 11.89,59.75 11.86,59.55 11.91,59.28 11.94,59 11.9,58.68 11.91,58.5 11.99,58.36 11.98,58.25 12.03,58.11 12.03,57.86 12.09,57.55 12.14,57.24 12.12,57.01 12.17,56.78 12.1,56.6 12.12,56.26 12.07,56.1 12.12,55.83 12.18,55.68 12.22,55.44 12.27,55.35 12.33,55.27 12.4,55.19 12.51,55.21 12.59,55.39 12.58,55.61 12.55,55.84 12.55,56.12 12.56,56.38 12.56,56.71 12.6,56.87 12.6,57.13 12.65,57.46 12.7,57.97 12.73,58.3 12.78,58.61 12.79,58.67 12.84,58.7 12.94,58.7 12.99,58.63 13.12,58.62 13.26,58.49 13.47,58.36 13.86,58.08 14.2,57.83 14.29,57.63 14.42,57.53 14.51,57.38 14.83,57.08 15,56.86 15.31,56.58 15.41,56.54 15.49,56.43 15.68,56.29 15.85,56.14 15.91,56.13 16.01,56.13 16.03,56.24 15.93,56.38 15.78,56.5 15.6,56.67 15.52,56.72 15.46,56.85 15.27,57.01 15.1,57.2 15.02,57.3 14.96,57.44 14.88,57.57 14.68,57.81 14.5,58.1 14.31,58.33 14.12,58.5 13.91,58.68 13.69,58.89 13.51,59.1 13.26,59.37 13.24,59.46 13.29,59.46 13.37,59.57 13.51,59.74 13.73,59.92 14.26,60.49 14.41,60.59
N$12
  pour Top (rank 2, no thermals): 33.15,61.3 33.13,61.28 33.11,61.26 33.1,61.23 33.08,61.21 33.06,61.19 33.04,61.17 33.03,61.15 33.01,61.13 32.99,61.11 32.97,61.09 32.95,61.07 32.93,61.05 32.91,61.04 32.89,61.02 32.87,61.01 32.85,61 32.82,60.99 32.8,60.98 32.76,60.97 32.62,60.84 32.48,60.77 32.37,60.72 32.23,60.59 32.08,60.57 31.97,60.35 31.82,60.17 31.68,59.91 31.61,59.63 31.57,59.59 31.56,59.57 31.54,59.55 31.52,59.52 31.51,59.5 31.49,59.48 31.48,59.45 31.47,59.43 31.45,59.4 31.44,59.37 31.43,59.16 31.37,59.07 31.37,58.93 31.3,58.67 31.36,58.44 31.4,58.16 31.37,57.94 31.41,57.63 31.48,57.33 31.59,57.04 31.76,56.8 31.9,56.65 32.16,56.38 32.61,56.09 32.86,55.94 33.17,55.87 33.51,55.83 33.87,55.88 34.2,55.99 34.44,56.13 34.63,56.34 34.79,56.56 34.91,56.74 35.04,57.04 35.22,57.55 35.3,58.06 35.24,58.33 35.21,58.62 35.1,58.79 34.97,59.17 34.93,59.4 34.79,59.54 34.69,59.75 34.48,59.87 34.26,60.02 34.07,60.02 33.94,59.92 33.87,59.72 33.84,59.5 34.02,59.24 34.12,59.02 34.25,58.92 34.34,58.74 34.36,58.47 34.4,58.3 34.34,58.12 34.31,57.9 34.24,57.7 34.25,57.41 34.14,57.34 34.13,56.96 33.99,56.84 33.75,56.76 33.51,56.69 33.3,56.72 33.16,56.76 33.09,56.83 32.97,56.86 32.8,57.28 32.62,57.5 32.58,57.85 32.45,58.22 32.52,58.58 32.56,58.98 32.7,59.38 32.86,59.61 33,59.94 33.2,60.23 33.52,60.25 33.78,60.38 33.99,60.6 34.02,60.82 33.96,61.12 33.8,61.31 33.61,61.45 33.39,61.5 33.25,61.42 33.23,61.4 33.21,61.37 33.19,61.35 33.17,61.33
N$13
  pour Top (rank 2, no thermals): 208 corners
N$14
  pour Top (rank 2, no thermals): 30.31,57.55 30.38,58.06 30.33,58.33 30.3,58.62 30.19,58.79 30.05,59.17 30.01,59.4 29.88,59.54 29.78,59.75 29.57,59.87 29.35,60.02 29.16,60.02 29.02,59.92 28.96,59.72 28.92,59.5 29.1,59.24 29.2,59.02 29.33,58.92 29.42,58.74 29.45,58.47 29.48,58.3 29.42,58.12 29.39,57.9 29.32,57.7 29.33,57.41 29.22,57.34 29.21,56.96 29.08,56.84 28.84,56.76 28.59,56.69 28.38,56.72 28.24,56.76 28.17,56.83 28.05,56.86 27.88,57.28 27.71,57.5 27.66,57.85 27.53,58.22 27.61,58.58 27.64,58.98 27.78,59.38 27.94,59.61 28.08,59.94 28.29,60.23 28.61,60.25 28.87,60.38 29.07,60.6 29.11,60.82 29.05,61.12 28.88,61.31 28.7,61.45 28.48,61.5 28.44,61.48 28.34,61.42 28.28,61.36 28.25,61.33 28.22,61.29 28.2,61.27 28.19,61.25 28.11,61.15 28.07,61.1 28.05,61.08 28.03,61.06 28.01,61.04 27.85,60.96 27.7,60.84 27.57,60.77 27.46,60.72 27.31,60.59 27.17,60.57 27.06,60.35 26.9,60.17 26.76,59.91 26.69,59.63 26.59,59.5 26.52,59.36 26.52,59.16 26.45,59.07 26.45,58.93 26.38,58.67 26.44,58.44 26.49,58.16 26.45,57.94 26.49,57.63 26.56,57.33 26.67,57.04 26.85,56.8 26.98,56.65 27.24,56.38 27.7,56.09 27.94,55.94 28.25,55.87 28.59,55.83 28.95,55.88 29.29,55.99 29.52,56.13 29.71,56.34 29.87,56.56 30,56.74 30.13,57.04
N$15
  Top 0.305: J1.1 86.07,30.09 R10.1 83.28,23.11 R5.2 86.02,18.36 R3.2
N$18
  Top 0.813: MDL1.3 R28.2
N$93
  Top 0.813: R50.1 84.4,79 83,79 79.7,82.3 LED1.3
N$94
  Top 0.813: R49.1 76.3,77.1 LED1.1
N$95
  Top 0.813: R48.1 78,80.4 LED1.2
RED  (via drill 0.35)
  Top 0.305: R62.1 58.1,63 59.9,61.2 v60.4,61.2 | v59.6,54.5 59.52,54.42 IC1.2
  Bottom 0.305: v60.4,61.2 61.9,59.7 61.9,56.4 60,54.5 v59.6,54.5
RED-LV  (via drill 0.35)
  Top 0.305: IC1.3 60.8,51.51 61.5,50.8 62.96,50.8 67.56,46.2 83.66,46.2 84.28,45.58 84.28,43.68 88.78,39.18 88.78,13.02 87.78,12.02 82.48,12.02 81.67,11.21 v81.49,11.21 | MDL1.6 59.1,11 60.59,12.49 69.58,12.49 70.6,11.48 v70.6,11.3
  Bottom 0.305: v81.49,11.21 81.37,11.08 81.19,11.08 80.73,10.62 71.28,10.62 v70.6,11.3
REDGND  (via drill 0.35)
  Top 0.305: LED1.5 v78,89.03
  Bottom 0.305: v78,89.03 77.88,88.91 63.84,88.91 CON25.4
  pour Top (rank 2, no thermals): 60.6,86.4 60.6,80.8 58.1,78.3 57.6,77.8 57.6,73.5 52.4,73.5 52.4,80.3 58.4,86.3 58.5,86.4
RESET  (via drill 0.35)
  Top 0.305: T1.C 33.4,21.9 34,22.5 v34,22.7 34,25.4 32.9,26.5 21.3,26.5 20.4,27.4 20.4,28.65 S1.1 | 55.3,21 53.77,22.53 v53.5,22.53
  Top 0.813: MDL1.1 55.3,21 R29.2
  Bottom 0.305: v53.5,22.53 52.23,22.53 52.11,22.41 34.29,22.41 v34,22.7
RTS
  Top 0.305: T1.E 28.95,22 R2.2 27.51,21.09 27.51,17.29 27.89,16.91 U$4.14
VM
  pour Top (rank 3, no thermals): 69.7,82.7 69.7,86.7 69.4,87 58,87 53.6,82.6 33.5,82.6 31.6,84.5 29.9,84.5 28,82.6 28,80 14,80 12.8,78.8 12.8,75.9 12.5,75.6 10.2,75.6 9.2,76.6 9.2,90.8 10.3,91.9 74.3,91.9 74.3,80.7 73.6,80 72.4,80
VUSB
  Top 0.813: J3.VBUS 35.17,6.98 D12.A

### Text on the board
Top: Made In: | BEAUFORT WEST | GPLv3 - Peter van der Walt (2018) | RESET | PROGRAM / MODE0 | LED MODE / MODE2
tPlace: POWER INPUT | LEDS | 220 | SS34 | RED | BLU | GRN | V+ | V+ | GND | 12V | 68uH | 330R | 330R | 330R | IRLR024 | IRLR024 | IRLR024 | XL1509-5 | 220 | 100K | 100K | 100K | D12: RED | D13: GREEN | 10R | 10R | 10R | D14: BLUE | 104 | CD4050 | GND | GND | press LED MODE to / cycle between available / modes | D5 | D4 | LDR | 10K | 10u | NCH | NCH | 10K | 10K | 1117-33 | 10K | 104 | 104 | 10K | 18pf | GND | 22K | 10K | 10K | 10K | 12Mhz | CH340 | 10u | 3V3 | 10u | 104 | 10K | 18pf | USB
tStop: Made In: | BEAUFORT WEST | GPLv3 - Peter van der Walt (2018) | RESET | PROGRAM / MODE0 | LED MODE / MODE2